# Altium project MSXIV_SolarSense.PrjPcb (part 1 of 3)
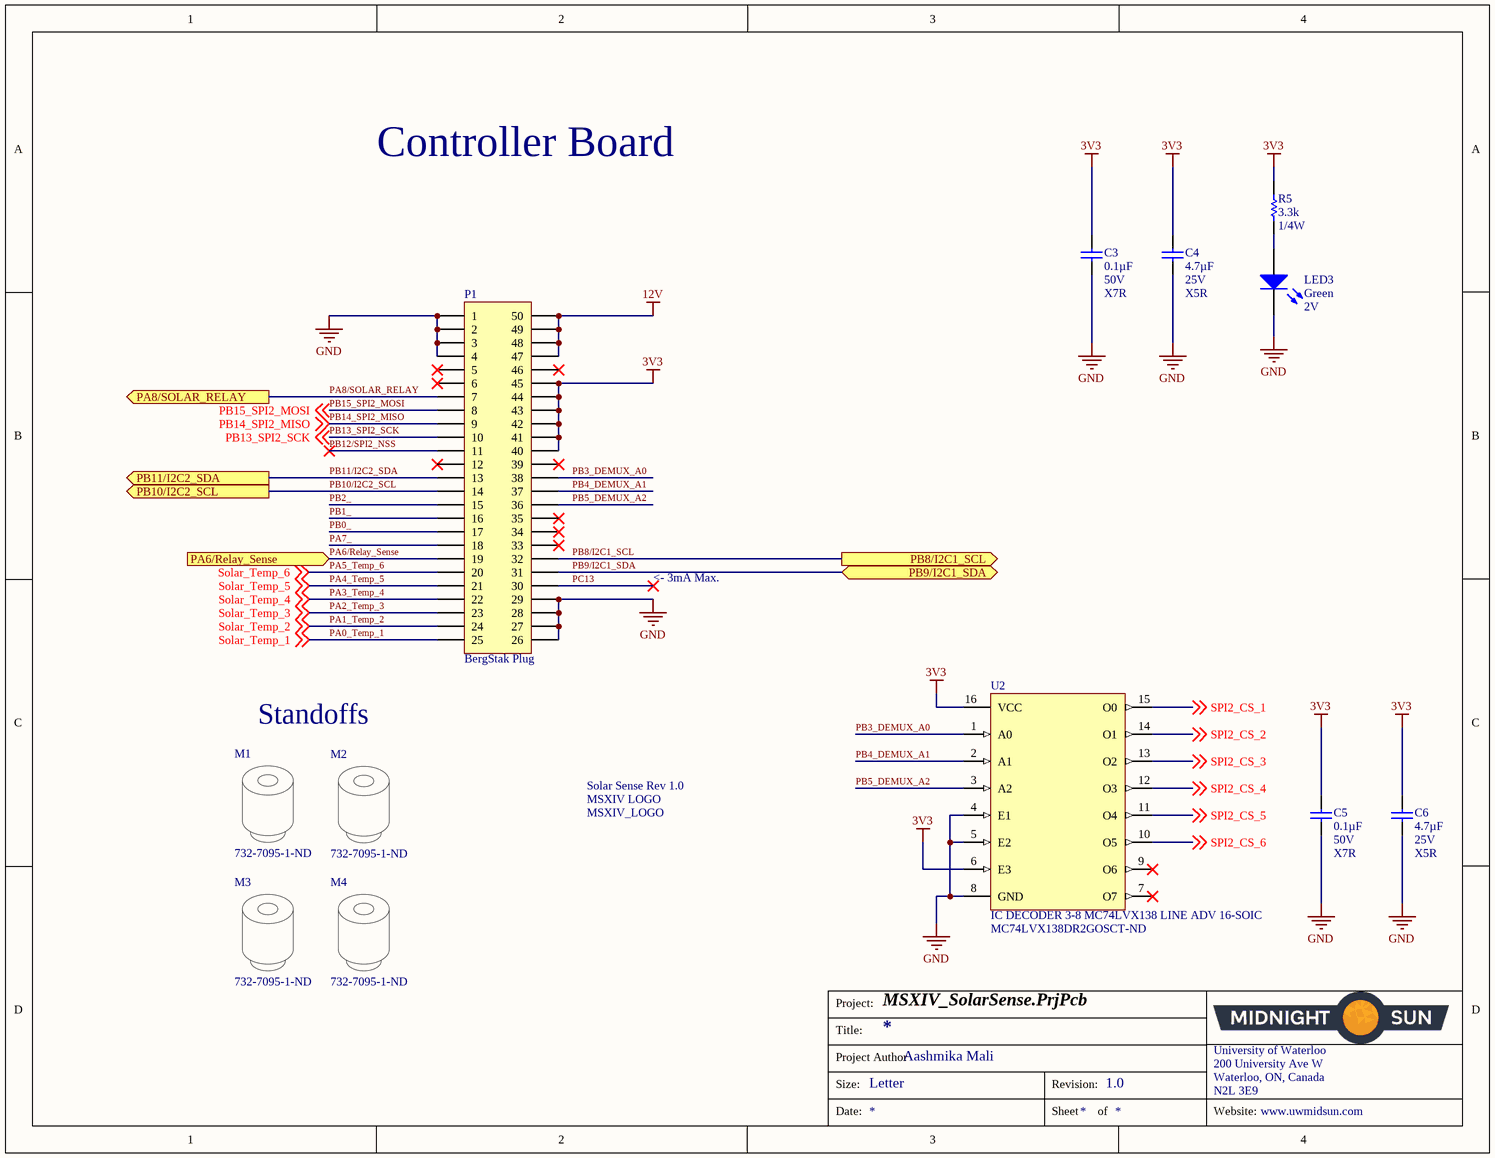
[diagram p0: Controller_Board_Interface.SchDoc]
ProjectAuthor: Aashmika Mali; ProjectRevision: 1.0
8 sheets, 208 parts. Net scope: flat (ports and power ports of the same name join across sheets).
Board file: SolarSense.PcbDoc
Sheets:
  Controller_Board_Interface.SchDoc
  Voltage_Sense.SchDoc
  ADCs.SchDoc
  SPI_Interface.SchDoc
  Current_and_Relay_Sense.SchDoc
  TemperatureSense.SchDoc
  I2C_Interface.SchDoc
  V_Sns_I2C_Isolators.SchDoc

## Sheet Controller_Board_Interface.SchDoc
size Letter; Organization: Midnight Sun Solar Rayce Car Team; Address1: University of Waterloo; Address2: 200 University Ave W; Address3: Waterloo, ON, Canada; Address4: N2L 3E9; Website: www.uwmidsun.com

### Parts
C3  Capacitance: 0.1µF  Voltage: 50V  Temperature Coefficient: X7R  [CAP, 0603]  (hidden comment: CAP CER 0.1UF 50V 10% X7R 0603)
C4  Capacitance: 4.7µF  Voltage: 25V  Temperature Coefficient: X5R  [CAP, 0603]  (hidden comment: CAP CER 4.7UF 25V 10% X5R 0603)
C5  Capacitance: 0.1µF  Voltage: 50V  Temperature Coefficient: X7R  [CAP, 0603]  (hidden comment: CAP CER 0.1UF 50V 10% X7R 0603)
C6  Capacitance: 4.7µF  Voltage: 25V  Temperature Coefficient: X5R  [CAP, 0603]  (hidden comment: CAP CER 4.7UF 25V 10% X5R 0603)
LED3  Color: Green  Voltage - Forward (Vf) (Typ): 2V  [LED_0603]  (hidden comment: LED GREEN CLEAR 2V 0603)
M1  Supplier Part Number 1: 732-7095-1-ND  [M2.5 Standoff]  (hidden comment: STANDOFF RND M2.5X0.45 STEEL 5MM)
M2  Supplier Part Number 1: 732-7095-1-ND  [M2.5 Standoff]  (hidden comment: STANDOFF RND M2.5X0.45 STEEL 5MM)
M3  Supplier Part Number 1: 732-7095-1-ND  [M2.5 Standoff]  (hidden comment: STANDOFF RND M2.5X0.45 STEEL 5MM)
M4  Supplier Part Number 1: 732-7095-1-ND  [M2.5 Standoff]  (hidden comment: STANDOFF RND M2.5X0.45 STEEL 5MM)
P1  Series: BergStak Plug  [CONN, Bergstak 50 Pos Plug]  (hidden comment: CONN 50POS Bergstak Plug 0.02")
R5  Resistance: 3.3k  Power: 1/4W  [RES, 0603]  (hidden comment: RES 3.3K OHM 1% 1/4W 0603)
Solar_Sense_Rev_1.0  MSXIV_LOGO  [MSXIV LOGO]
U2  IC DECODER 3-8 MC74LVX138 LINE ADV 16-SOIC  Supplier Part Number 1: MC74LVX138DR2GOSCT-ND  [SOIC-16 CASE 751B-05 ISSUE K MC74LVX138]

### Ports
PA6/Relay_Sense (in), PA8/SOLAR_RELAY (out), PB8/I2C1_SCL (out), PB9/I2C1_SDA (bidir), PB10/I2C2_SCL (out), PB11/I2C2_SDA (out)

### Nets
3V3: C3.1 C4.1 C5.1 C6.1 P1.40 P1.41 P1.42 P1.43 P1.44 P1.45 R5.1 U2.6(E3) U2.16(VCC)
12V: P1.47 P1.48 P1.49 P1.50
GND: C3.2 C4.2 C5.2 C6.2 LED3.2(K) P1.1 P1.2 P1.3 P1.4 P1.26 P1.27 P1.28 P1.29 U2.4(E1) U2.5(E2) U2.8(GND)
PA0_Temp_1: P1.25 ; off-sheet Solar_Temp_1  [also labelled Solar_Temp_1]
PA1_Temp_2: P1.24 ; off-sheet Solar_Temp_2  [also labelled Solar_Temp_2]
PA2_Temp_3: P1.23 ; off-sheet Solar_Temp_3  [also labelled Solar_Temp_3]
PA3_Temp_4: P1.22 ; off-sheet Solar_Temp_4  [also labelled Solar_Temp_4]
PA4_Temp_5: P1.21 ; off-sheet Solar_Temp_5  [also labelled Solar_Temp_5]
PA5_Temp_6: P1.20 ; off-sheet Solar_Temp_6  [also labelled Solar_Temp_6]
PA6/Relay_Sense: P1.19 ; port PA6/Relay_Sense
PA7_: P1.18
PA8/SOLAR_RELAY: P1.7 ; port PA8/SOLAR_RELAY
PB0_: P1.17
PB1_: P1.16
PB2_: P1.15
PB3_DEMUX_A0: P1.38 U2.1(A0)
PB4_DEMUX_A1: P1.37 U2.2(A1)
PB5_DEMUX_A2: P1.36 U2.3(A2)
PB8/I2C1_SCL: P1.32 ; port PB8/I2C1_SCL
PB9/I2C1_SDA: P1.31 ; port PB9/I2C1_SDA
PB10/I2C2_SCL: P1.14 ; port PB10/I2C2_SCL
PB11/I2C2_SDA: P1.13 ; port PB11/I2C2_SDA
PB12/SPI2_NSS: P1.11
PB13_SPI2_SCK: P1.10 ; off-sheet PB13_SPI2_SCK
PB14_SPI2_MISO: P1.9 ; off-sheet PB14_SPI2_MISO
PB15_SPI2_MOSI: P1.8 ; off-sheet PB15_SPI2_MOSI
PC13: P1.30
SPI2_CS_1: U2.15(O0) ; off-sheet SPI2_CS_1
SPI2_CS_2: U2.14(O1) ; off-sheet SPI2_CS_2
SPI2_CS_3: U2.13(O2) ; off-sheet SPI2_CS_3
SPI2_CS_4: U2.12(O3) ; off-sheet SPI2_CS_4
SPI2_CS_5: U2.11(O4) ; off-sheet SPI2_CS_5
SPI2_CS_6: U2.10(O5) ; off-sheet SPI2_CS_6
NetLED3_1: LED3.1(A) R5.2

Not connected (* = marked no-connect by the designer): P1 5* 6* 12* 33* 34* 35* 39* 46*; U2 7(O7)* 9(O6)*

### Notes on the sheet
- Controller Board
- <- 3mA Max.
- Standoffs
- Project:
- Title:
- Size:
- Project Author
- Letter
- Revision:
- University of Waterloo
- 200 University Ave W
- Waterloo, ON, Canada
- N2L 3E9
- Date:
- Sheet
- of
- Website:
- (in symbol MSXIV_LOGO) MSXIV LOGO

### Library data of the parts
C3 C5 = CAP CER 0.1UF 50V 10% X7R 0603: 0.10µF ±10% 50V Ceramic Capacitor X7R 0603 (1608 Metric); Manufacturer 1: AVX Corporation; Manufacturer Part Number 1: 06035C104KAT2A; Supplier 1: Digi-Key; Supplier Part Number 1: 478-5052-1-ND; Packaging: Cut Tape (CT); Part Status: Active; Operating Temperature: -55°C ~ 125°C; Ratings: -; Mounting Type: Surface Mount, MLCC; Package / Case: 0603 (1608 Metric); Size / Dimension: 0.063" L x 0.032" W (1.60mm x 0.81mm); Height - Seated (Max): -; Thickness (Max): 0.035" (0.90mm); Lead Spacing: -; Lead Style: -; ComponentLink1URL: http://datasheets.avx.com/X7RDielectric.pdf; ComponentLink1Description: http://datasheets.avx.com/X7RDielectric.pdf; Tolerance: ±10%
C4 C6 = CAP CER 4.7UF 25V 10% X5R 0603: 4.7µF ±10% 25V Ceramic Capacitor X5R 0603 (1608 Metric); Manufacturer 1: Murata Electronics North America; Manufacturer Part Number 1: GRM188R61E475KE11D; Supplier 1: Digi-Key; Supplier Part Number 1: 490-7203-1-ND; Packaging: Cut Tape (CT); Part Status: Active; Operating Temperature: -55°C ~ 85°C; Ratings: -; Mounting Type: Surface Mount, MLCC; Package / Case: 0603 (1608 Metric); Size / Dimension: 0.063" L x 0.031" W (1.60mm x 0.80mm); Height - Seated (Max): -; Thickness (Max): 0.031" (0.80mm); Lead Spacing: -; Lead Style: -; ComponentLink1URL: http://www.murata.com/~/media/webrenewal/support/library/catalog/products/capacitor/mlcc/c02e.ashx; ComponentLink1Description: http://www.murata.com/~/media/webrenewal/support/library/catalog/products/capacitor/mlcc/c02e.ashx; Tolerance: ±10%
LED3 = LED GREEN CLEAR 2V 0603: Green 572nm LED Indication - Discrete 2V 0603 (1608 Metric); Manufacturer: Wurth Electronics Inc.; Manufacturer Part Number: 150060VS75000; Lens Color: Colorless; Millicandela Rating: 40mcd; Lens Style/Size: Rectangle with Flat Top, 1.10mm x 0.70mm; Current - Test: 20mA; Viewing Angle: 140°; Wavelength - Dominant: 570nm; Supplier 1: Digi-Key; RoHS: RoHS Compliant; Category: Optoelectronics; Stock 1: 9408; Pricing 1: 1=0.21, 100=0.1617, 500=0.13964 (CAD); Packaging: Cut Tape (CT); Part Status: Active; Lens Transparency: Clear; Mounting Type: Surface Mount; Wavelength - Peak: 572nm; Features: -; Package / Case: 0603 (1608 Metric); Supplier Device Package: 0603; Size / Dimension: 1.60mm L x 0.80mm W; Height (Max): 0.80mm; ComponentLink1URL: http://katalog.we-online.de/led/datasheet/150060VS75000.pdf; ComponentLink1Description: http://katalog.we-online.de/led/datasheet/150060VS75000.pdf; Supplier Part Number 1: 732-4980-1-ND
M1-M4 = STANDOFF RND M2.5X0.45 STEEL 5MM: Manufacturer: Wurth Electronics; Manufacturer Part Number: 9774050151R; Plating: Tin; Threaded/Unthreaded: Threaded; Outside Diameter: 0.201inch; Supplier 1: Digi-Key; RoHS: Yes; Stock 1: 24846; Pricing 1: 1 = 1.09000, 10 = 1.03000, 50 = 0.91800, 100 = 0.84000 (USD); Material: Steel; Length: 0.252inch; REACH SVHC: Unknown
P1 = CONN 50POS Bergstak Plug 0.02": 50 Position Connector Plug, Outer Shroud Contacts Surface Mount Gold; Manufacturer 1: Amphenol FCI; Manufacturer Part Number 1: 10132797-055100LF; Number of Positions: 50; Mated Stacking Heights: 5mm; Pitch: 0.020" (0.50mm); Supplier 1: Digi-Key; Supplier Part Number 1: 609-5226-1-ND; Packaging: Cut Tape (CT); Part Status: Active; Connector Type: Plug, Outer Shroud Contacts; Number of Rows: 2; Mounting Type: Surface Mount; Contact Finish: Gold; Contact Finish Thickness: 1µin (0.025µm); Height Above Board: 0.169" (4.30mm); ComponentLink1URL: http://portal.fciconnect.com/Comergent//fci/drawing/10132797.pdf; ComponentLink1Description: http://portal.fciconnect.com/Comergent//fci/drawing/10132797.pdf
R5 = RES 3.3K OHM 1% 1/4W 0603: 3.3k Ohm ±1% 0.25W, 1/4W Chip Resistor 0603 (1608 Metric) Automotive AEC-Q200, Pulse Withstanding Thick Film; Manufacturer 1: Panasonic Electronic Components; Manufacturer Part Number 1: ERJ-PA3F3301V; Temperature Coefficient: ±100ppm/°C; Supplier 1: Digi-Key; Supplier Part Number 1: P3.3KBYCT-ND; Packaging: Cut Tape (CT); Part Status: Active; Composition: Thick Film; Operating Temperature: -55°C ~ 155°C; Package / Case: 0603 (1608 Metric); Supplier Device Package: 0603; Size / Dimension: 0.063" L x 0.031" W (1.60mm x 0.80mm); Height - Seated (Max): 0.022" (0.55mm); Failure Rate: -; ComponentLink1URL: https://industrial.panasonic.com/cdbs/www-data/pdf/RDO0000/AOA0000C291.pdf; ComponentLink1Description: https://industrial.panasonic.com/cdbs/www-data/pdf/RDO0000/AOA0000C291.pdf; Tolerance: ±1%
U2 = IC DECODER 3-8 MC74LVX138 LINE ADV 16-SOIC: Decoder/Demultiplexer 1 x 3:8 16-SOIC; Manufacturer: ON Semiconductor; Manufacturer Part Number: MC74LVX138DR2G; Number of Inputs: 3; Number of Outputs: 8; Propagation Delay: 23ns; Max Supply Voltage: 3.6V; Min Supply Voltage: 2V; Logic Function: Demultiplexer,Decoder; Number of Elements: 1; High Level Output Current: 4mA; Polarity: Inverting; Quiescent Current: 4uA; Supply Type: Single; Supplier 1: Digi-Key; RoHS: Yes; Category: Decoders, Multiplexers; Stock 1: 2170; Pricing 1: 1=0.45000, 10=0.36100, 100=0.24590, 500=0.18442, 1000=0.13831 (USD); Mount: Surface Mount; Case/Package: SOIC; Number of Pins: 16; Min Operating Temperature: -40°C; Max Operating Temperature: 85°C; Packaging: Tape and Reel; Package Quantity: 2500; Low Level Output Current: 4mA; Number of Input Lines: 3; Number of Output Lines: 8; Turn-On Delay Time: 23ns; Independent Circuits: 1; Length: 10mm; Height: 1.5mm; Width: 4mm; Lead Free: Lead Free; Halogen Free: Halogen Free; ComponentLink1URL: https://datasheet.ciiva.com/6615/mc74lvx138-d-6615404.pdf?src-supplier=Digi-Key; ComponentLink1Description: https://datasheet.ciiva.com/6615/mc74lvx138-d-6615404.pdf?src-supplier=Digi-Key; ComponentLink2URL: https://datasheet.ciiva.com/16386/mc74lvx138-d-16386958.pdf?src-supplier=Future+Electronics; ComponentLink2Description: https://datasheet.ciiva.com/16386/mc74lvx138-d-16386958.pdf?src-supplier=Future+Electronics; ComponentLink3URL: https://datasheet.ciiva.com/6615/mc74lvx138-d-6615402.pdf?src-supplier=Digi-Key; ComponentLink3Description: https://datasheet.ciiva.com/6615/mc74lvx138-d-6615402.pdf?src-supplier=Digi-Key; ComponentLink4URL: https://datasheet.ciiva.com/6615/mc74lvx138-d-6615405.pdf?src-supplier=Digi-Key; ComponentLink4Description: https://datasheet.ciiva.com/6615/mc74lvx138-d-6615405.pdf?src-supplier=Digi-Key

## Sheet Voltage_Sense.SchDoc: Solar Sense Slave
size Tabloid; SheetNumber: 3; SheetTotal: 4; Website: www.uwmidsun.com
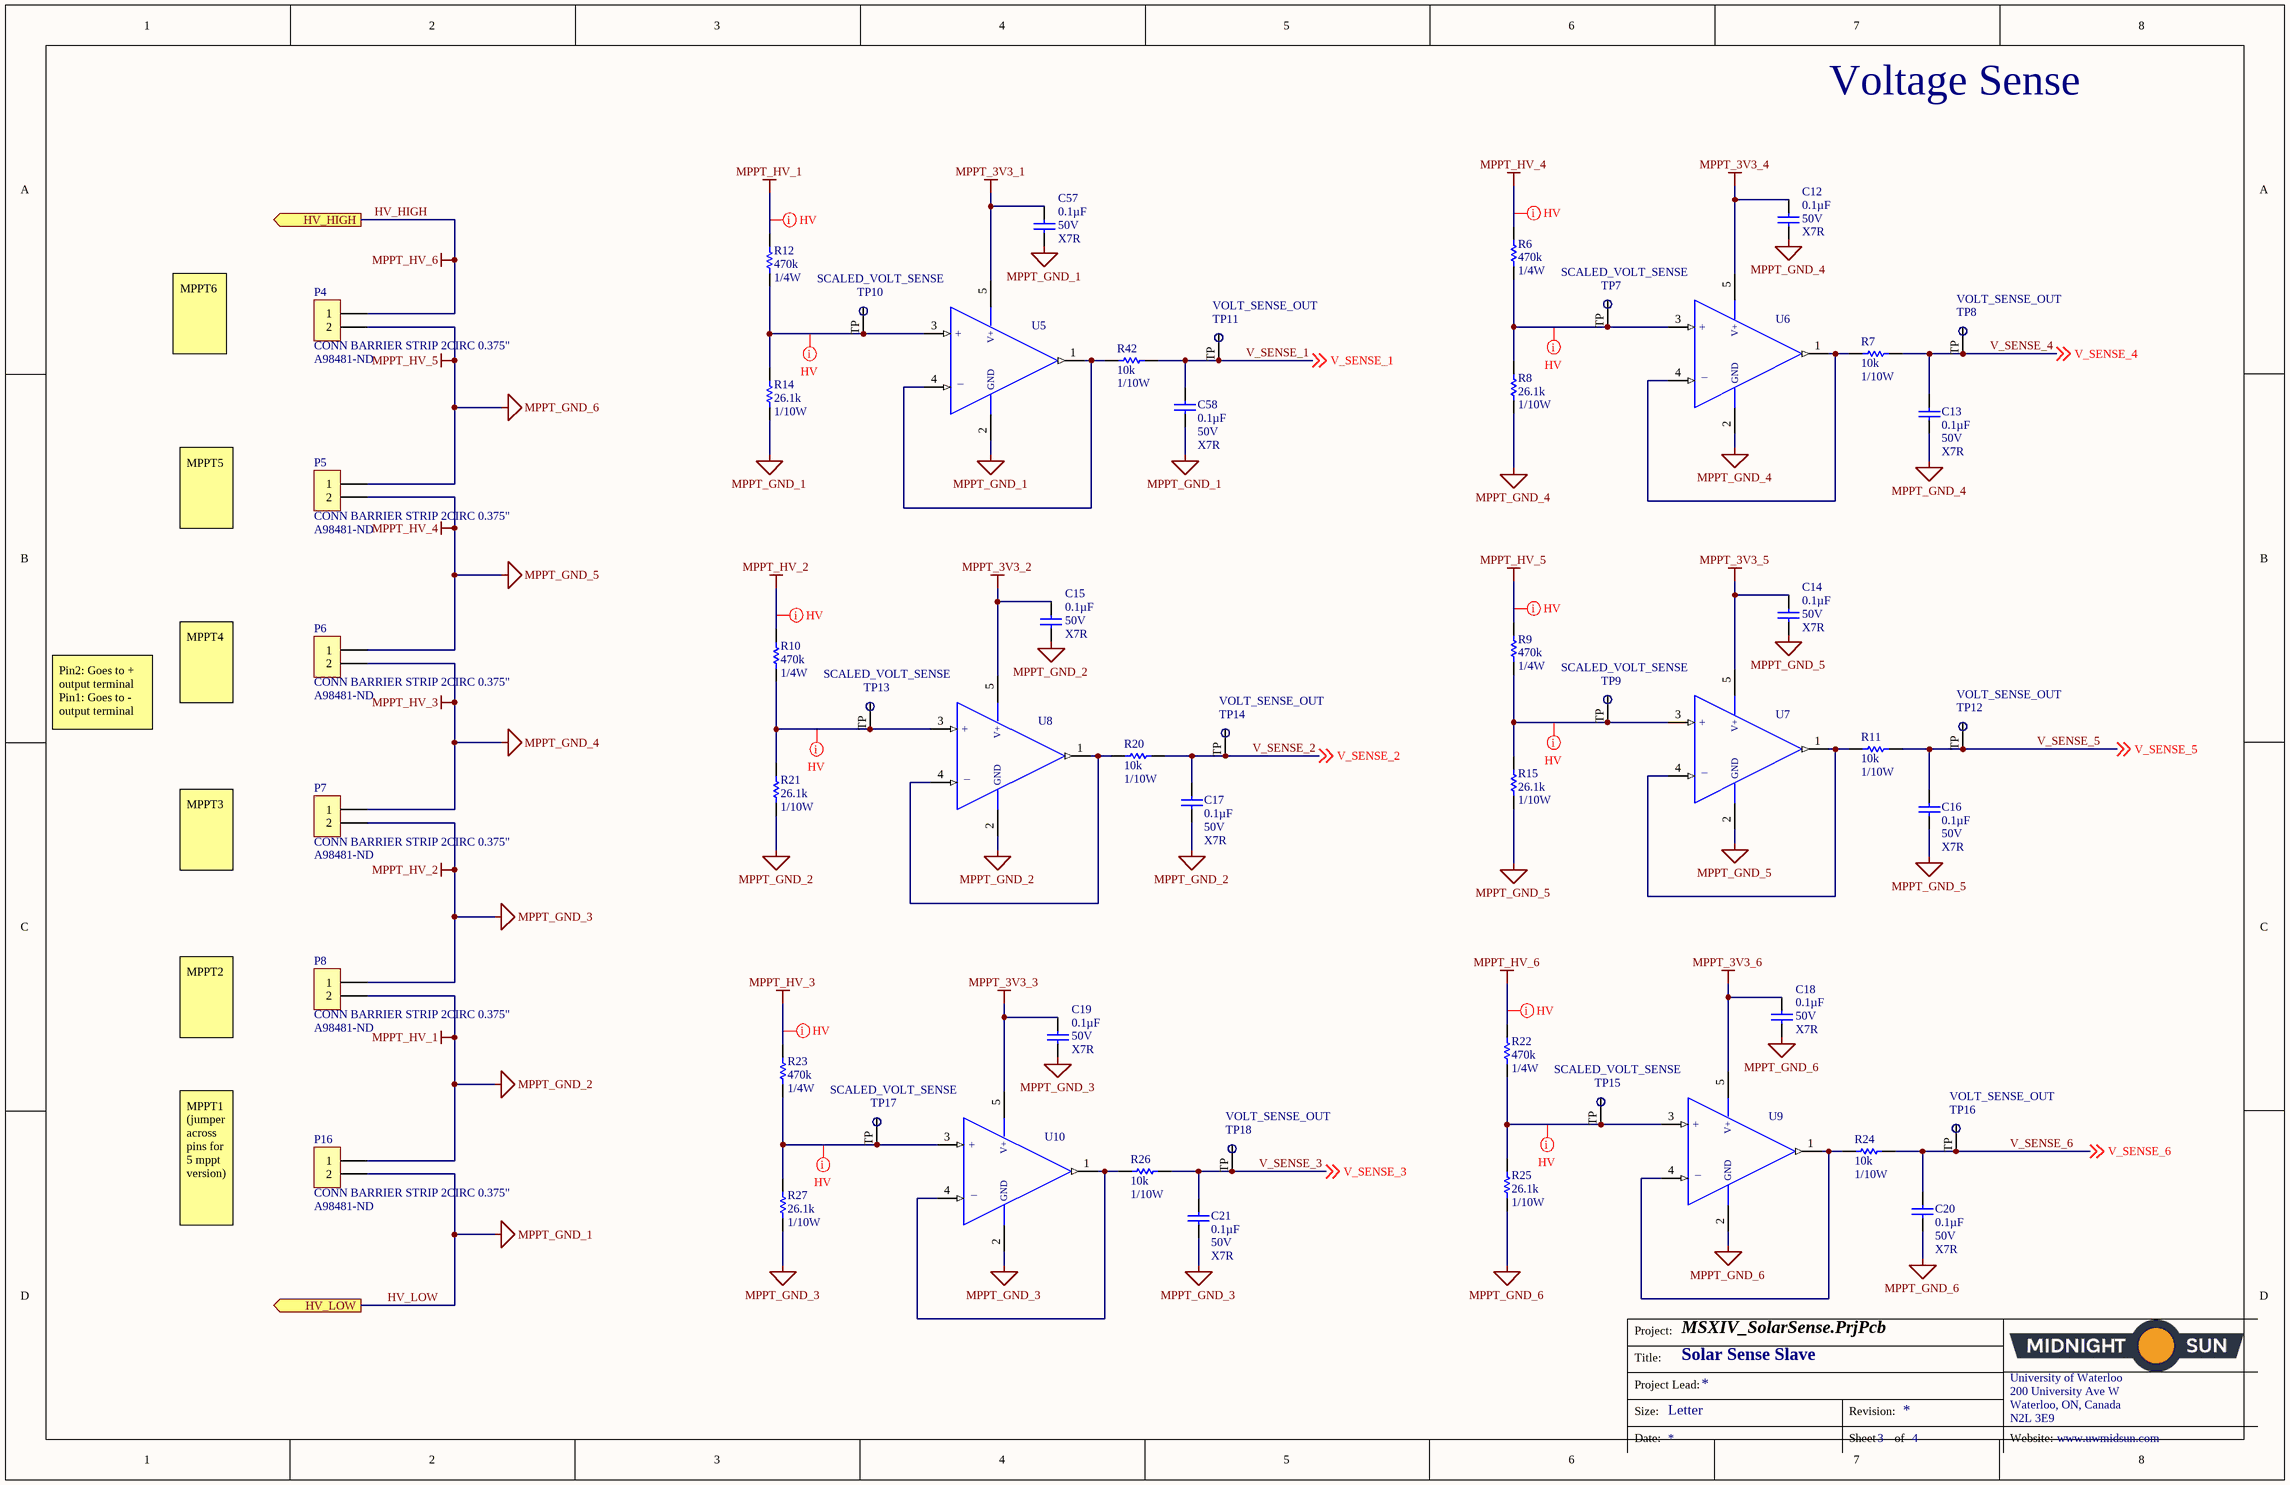
[diagram p1: Voltage_Sense.SchDoc]

### Parts
C12  Capacitance: 0.1µF  Voltage: 50V  Temperature Coefficient: X7R  [CAP, 0603]  (hidden comment: CAP CER 0.1UF 50V 10% X7R 0603)
C13  Capacitance: 0.1µF  Voltage: 50V  Temperature Coefficient: X7R  [CAP, 0603]  (hidden comment: CAP CER 0.1UF 50V 10% X7R 0603)
C14  Capacitance: 0.1µF  Voltage: 50V  Temperature Coefficient: X7R  [CAP, 0603]  (hidden comment: CAP CER 0.1UF 50V 10% X7R 0603)
C15  Capacitance: 0.1µF  Voltage: 50V  Temperature Coefficient: X7R  [CAP, 0603]  (hidden comment: CAP CER 0.1UF 50V 10% X7R 0603)
C16  Capacitance: 0.1µF  Voltage: 50V  Temperature Coefficient: X7R  [CAP, 0603]  (hidden comment: CAP CER 0.1UF 50V 10% X7R 0603)
C17  Capacitance: 0.1µF  Voltage: 50V  Temperature Coefficient: X7R  [CAP, 0603]  (hidden comment: CAP CER 0.1UF 50V 10% X7R 0603)
C18  Capacitance: 0.1µF  Voltage: 50V  Temperature Coefficient: X7R  [CAP, 0603]  (hidden comment: CAP CER 0.1UF 50V 10% X7R 0603)
C19  Capacitance: 0.1µF  Voltage: 50V  Temperature Coefficient: X7R  [CAP, 0603]  (hidden comment: CAP CER 0.1UF 50V 10% X7R 0603)
C20  Capacitance: 0.1µF  Voltage: 50V  Temperature Coefficient: X7R  [CAP, 0603]  (hidden comment: CAP CER 0.1UF 50V 10% X7R 0603)
C21  Capacitance: 0.1µF  Voltage: 50V  Temperature Coefficient: X7R  [CAP, 0603]  (hidden comment: CAP CER 0.1UF 50V 10% X7R 0603)
C57  Capacitance: 0.1µF  Voltage: 50V  Temperature Coefficient: X7R  [CAP, 0603]  (hidden comment: CAP CER 0.1UF 50V 10% X7R 0603)
C58  Capacitance: 0.1µF  Voltage: 50V  Temperature Coefficient: X7R  [CAP, 0603]  (hidden comment: CAP CER 0.1UF 50V 10% X7R 0603)
P4  CONN BARRIER STRIP 2CIRC 0.375"  Supplier Part Number 1: A98481-ND  [TE_3-1437652-9]
P5  CONN BARRIER STRIP 2CIRC 0.375"  Supplier Part Number 1: A98481-ND  [TE_3-1437652-9]
P6  CONN BARRIER STRIP 2CIRC 0.375"  Supplier Part Number 1: A98481-ND  [TE_3-1437652-9]
P7  CONN BARRIER STRIP 2CIRC 0.375"  Supplier Part Number 1: A98481-ND  [TE_3-1437652-9]
P8  CONN BARRIER STRIP 2CIRC 0.375"  Supplier Part Number 1: A98481-ND  [TE_3-1437652-9]
P16  CONN BARRIER STRIP 2CIRC 0.375"  Supplier Part Number 1: A98481-ND  [TE_3-1437652-9]
R6  Resistance: 470k  Power: 1/4W  [RES, 0603]  (hidden comment: RES 470K OHM 1% 1/4W 0603)
R7  Resistance: 10k  Power: 1/10W  [RES, 0603]  (hidden comment: RES 10K OHM 1% 1/10W 0603)
R8  Resistance: 26.1k  Power: 1/10W  [RES, 0603]  (hidden comment: RES 26.1K OHM 1% 1/10W 0603)
R9  Resistance: 470k  Power: 1/4W  [RES, 0603]  (hidden comment: RES 470K OHM 1% 1/4W 0603)
R10  Resistance: 470k  Power: 1/4W  [RES, 0603]  (hidden comment: RES 470K OHM 1% 1/4W 0603)
R11  Resistance: 10k  Power: 1/10W  [RES, 0603]  (hidden comment: RES 10K OHM 1% 1/10W 0603)
R12  Resistance: 470k  Power: 1/4W  [RES, 0603]  (hidden comment: RES 470K OHM 1% 1/4W 0603)
R14  Resistance: 26.1k  Power: 1/10W  [RES, 0603]  (hidden comment: RES 26.1K OHM 1% 1/10W 0603)
R15  Resistance: 26.1k  Power: 1/10W  [RES, 0603]  (hidden comment: RES 26.1K OHM 1% 1/10W 0603)
R20  Resistance: 10k  Power: 1/10W  [RES, 0603]  (hidden comment: RES 10K OHM 1% 1/10W 0603)
R21  Resistance: 26.1k  Power: 1/10W  [RES, 0603]  (hidden comment: RES 26.1K OHM 1% 1/10W 0603)
R22  Resistance: 470k  Power: 1/4W  [RES, 0603]  (hidden comment: RES 470K OHM 1% 1/4W 0603)
R23  Resistance: 470k  Power: 1/4W  [RES, 0603]  (hidden comment: RES 470K OHM 1% 1/4W 0603)
R24  Resistance: 10k  Power: 1/10W  [RES, 0603]  (hidden comment: RES 10K OHM 1% 1/10W 0603)
R25  Resistance: 26.1k  Power: 1/10W  [RES, 0603]  (hidden comment: RES 26.1K OHM 1% 1/10W 0603)
R26  Resistance: 10k  Power: 1/10W  [RES, 0603]  (hidden comment: RES 10K OHM 1% 1/10W 0603)
R27  Resistance: 26.1k  Power: 1/10W  [RES, 0603]  (hidden comment: RES 26.1K OHM 1% 1/10W 0603)
R42  Resistance: 10k  Power: 1/10W  [RES, 0603]  (hidden comment: RES 10K OHM 1% 1/10W 0603)
TP7  SCALED_VOLT_SENSE  [Test Point]  (no BOM)
TP8  VOLT_SENSE_OUT  [Test Point]
TP9  SCALED_VOLT_SENSE  [Test Point]  (no BOM)
TP10  SCALED_VOLT_SENSE  [Test Point]  (no BOM)
TP11  VOLT_SENSE_OUT  [Test Point]
TP12  VOLT_SENSE_OUT  [Test Point]
TP13  SCALED_VOLT_SENSE  [Test Point]  (no BOM)
TP14  VOLT_SENSE_OUT  [Test Point]
TP15  SCALED_VOLT_SENSE  [Test Point]  (no BOM)
TP16  VOLT_SENSE_OUT  [Test Point]
TP17  SCALED_VOLT_SENSE  [Test Point]  (no BOM)
TP18  VOLT_SENSE_OUT  [Test Point]
U5  IC OP AMP GEN PURPOSE RR 10MHZ SOT-23-5  [IC OP AMP GP RR 10MHZ SOT-23-5]  (value not drawn)
U6  IC OP AMP GEN PURPOSE RR 10MHZ SOT-23-5  [IC OP AMP GP RR 10MHZ SOT-23-5]  (value not drawn)
U7  IC OP AMP GEN PURPOSE RR 10MHZ SOT-23-5  [IC OP AMP GP RR 10MHZ SOT-23-5]  (value not drawn)
U8  IC OP AMP GEN PURPOSE RR 10MHZ SOT-23-5  [IC OP AMP GP RR 10MHZ SOT-23-5]  (value not drawn)
U9  IC OP AMP GEN PURPOSE RR 10MHZ SOT-23-5  [IC OP AMP GP RR 10MHZ SOT-23-5]  (value not drawn)
U10  IC OP AMP GEN PURPOSE RR 10MHZ SOT-23-5  [IC OP AMP GP RR 10MHZ SOT-23-5]  (value not drawn)

### Ports
HV_HIGH (out), HV_LOW (out)

### Nets
HV_HIGH: P4.1 R22.1 ; port HV_HIGH  [also labelled MPPT_HV_6]
HV_LOW: C57.2 C58.2 P16.2 R14.2 U5.2(VSS) ; port HV_LOW  [also labelled MPPT_GND_1]  [project net HV_HIGH_NEG_BAT_TERM]
MPPT_3V3_1: C57.1 U5.5(VDD)
MPPT_3V3_2: C15.1 U8.5(VDD)
MPPT_3V3_3: C19.1 U10.5(VDD)
MPPT_3V3_4: C12.1 U6.5(VDD)
MPPT_3V3_5: C14.1 U7.5(VDD)
MPPT_3V3_6: C18.1 U9.5(VDD)
MPPT_GND_2: C15.2 C17.2 P8.2 P16.1 R12.1 R21.2 U8.2(VSS)  [also labelled MPPT_HV_1]
MPPT_GND_3: C19.2 C21.2 P7.2 P8.1 R10.1 R27.2 U10.2(VSS)  [also labelled MPPT_HV_2]
MPPT_GND_4: C12.2 C13.2 P6.2 P7.1 R8.2 R23.1 U6.2(VSS)  [also labelled MPPT_HV_3]
MPPT_GND_5: C14.2 C16.2 P5.2 P6.1 R6.1 R15.2 U7.2(VSS)  [also labelled MPPT_HV_4]
MPPT_GND_6: C18.2 C20.2 P4.2 P5.1 R9.1 R25.2 U9.2(VSS)  [also labelled MPPT_HV_5]
V_SENSE_1: C58.1 R42.2 TP11.TP ; off-sheet V_SENSE_1
V_SENSE_2: C17.1 R20.2 TP14.TP ; off-sheet V_SENSE_2
V_SENSE_3: C21.1 R26.2 TP18.TP ; off-sheet V_SENSE_3
V_SENSE_4: C13.1 R7.2 TP8.TP ; off-sheet V_SENSE_4
V_SENSE_5: C16.1 R11.2 TP12.TP ; off-sheet V_SENSE_5
V_SENSE_6: C20.1 R24.2 TP16.TP ; off-sheet V_SENSE_6
NetR6_2: R6.2 R8.1 TP7.TP U6.3(+IN)
NetR7_1: R7.1 U6.1(OUTPUT) U6.4(-IN)
NetR9_2: R9.2 R15.1 TP9.TP U7.3(+IN)
NetR10_2: R10.2 R21.1 TP13.TP U8.3(+IN)
NetR11_1: R11.1 U7.1(OUTPUT) U7.4(-IN)
NetR12_2: R12.2 R14.1 TP10.TP U5.3(+IN)
NetR20_1: R20.1 U8.1(OUTPUT) U8.4(-IN)
NetR22_2: R22.2 R25.1 TP15.TP U9.3(+IN)
NetR23_2: R23.2 R27.1 TP17.TP U10.3(+IN)
NetR24_1: R24.1 U9.1(OUTPUT) U9.4(-IN)
NetR26_1: R26.1 U10.1(OUTPUT) U10.4(-IN)
NetR42_1: R42.1 U5.1(OUTPUT) U5.4(-IN)

### Layout directives
net class HV: HV_HIGH, MPPT_GND_2, MPPT_GND_3, MPPT_GND_4, MPPT_GND_5, MPPT_GND_6, NetR6_2, NetR9_2, NetR10_2, NetR12_2, NetR22_2, NetR23_2

### Notes on the sheet
- Voltage Sense
- MPPT6
- MPPT5
- MPPT4
- Pin2: Goes to + output terminal
  Pin1: Goes to - output terminal
- MPPT3
- MPPT2
- MPPT1 (jumper across pins for 5 mppt version)
- Project:
- Title:
- Size:
- Project Lead:
- Letter
- Revision:
- University of Waterloo
- 200 University Ave W
- Waterloo, ON, Canada
- N2L 3E9
- Date:
- Sheet
- of
- Website:
- (in symbol IC OP AMP GEN PURPOSE RR 10MHZ SOT-23-5) V+; +; GND; _

### Library data of the parts
C12-C21 C57 C58 = CAP CER 0.1UF 50V 10% X7R 0603: as C3 on sheet Controller_Board_Interface; Supplier 1: Digi-Key; Supplier Part Number 1: 478-5052-1-ND; Packaging: Cut Tape (CT); Part Status: Active; Operating Temperature: -55°C ~ 125°C; Ratings: -; Mounting Type: Surface Mount, MLCC; Package / Case: 0603 (1608 Metric); Size / Dimension: 0.063" L x 0.032" W (1.60mm x 0.81mm); Height - Seated (Max): -; Thickness (Max): 0.035" (0.90mm); Lead Spacing: -; Lead Style: -; ComponentLink1URL: http://datasheets.avx.com/X7RDielectric.pdf; ComponentLink1Description: http://datasheets.avx.com/X7RDielectric.pdf; Tolerance: ±10%
P4-P8 P16 = CONN BARRIER STRIP 2CIRC 0.375": Barrier Terminal Blocks 2P TRI-BARRIER .375; Manufacturer: TE Connectivity; Manufacturer Part Number: 6PCV-02-006; Current Rating: 5A; Voltage Rating: 300V; Number of Contacts: 2; Max Current Rating: 25A; Mounting Ears: No (Without); Number of Levels: 1; Wire Gauge (Max): 12AWG; Wire Gauge (Min): 22AWG; Pitch: 9.53mm; Supplier 1: Digi-Key; RoHS: Yes; Category: Terminal Blocks; Stock 1: 8088; Pricing 1: 1=1.63000, 10=1.14400, 25=1.06680, 50=0.96820, 100=0.96400, 250=0.81404, 500=0.77122, 1000=0.68552, 5000=0.55699 (USD); Mount: Through Hole; Color: Black; Terminal Material: Copper Alloy; Contact Plating: Tin; Contact Material: Copper Alloy; Housing Color: Black; Housing Material: Thermoplastic; Package Quantity: 270; Number of Rows: 1; Packaging: Bulk; Termination: Solder; Number of Circuits: 2; Orientation: Straight; Number of Positions: 2; Mounting Insert: No (Without); Voltage: 300V; Length: 0.811inch; Height: 0.625inch; Wire/Cable Gauge: 22AWG; Width: 0.7inch; Flammability Rating: UL94 V-0; REACH SVHC: Unknown; ELV: Compliant; ComponentLink1URL: https://datasheet.ciiva.com/7978/1650932-7978603.pdf?src-supplier=Element14; ComponentLink1Description: https://datasheet.ciiva.com/7978/1650932-7978603.pdf?src-supplier=Element14
R6 R9 R10 R12 R22 R23 = RES 470K OHM 1% 1/4W 0603: RES SMD 470K OHM 1% 1/4W 0603; Manufacturer 1: Panasonic Electronic Components; Manufacturer Part Number 1: ERJ-PA3F4703V; Temperature Coefficient: ±100ppm/°C; Supplier 1: Digi-Key; Supplier Part Number 1: P470KBYCT-ND; Packaging: Cut Tape (CT); Part Status: Active; Composition: Thick Film; Operating Temperature: -55°C ~ 155°C; Package / Case: 0603 (1608 Metric); Supplier Device Package: 0603; Size / Dimension: 0.063" L x 0.031" W (1.60mm x 0.80mm); Height - Seated (Max): 0.022" (0.55mm); Failure Rate: -; ComponentLink1URL: https://industrial.panasonic.com/cdbs/www-data/pdf/RDO0000/AOA0000C291.pdf; ComponentLink1Description: https://industrial.panasonic.com/cdbs/www-data/pdf/RDO0000/AOA0000C291.pdf; Tolerance: ±1%
R7 R11 R20 R24 R26 R42 = RES 10K OHM 1% 1/10W 0603: RES SMD 10K OHM 1% 1/10W 0603; Manufacturer 1: Yageo; Manufacturer Part Number 1: RC0603FR-0710KL; Temperature Coefficient: ±100ppm/°C; Supplier 1: Digi-Key; Supplier Part Number 1: 311-10.0KHRCT-ND; Packaging: Cut Tape (CT); Part Status: Active; Composition: Thick Film; Operating Temperature: -55°C ~ 155°C; Package / Case: 0603 (1608 Metric); Supplier Device Package: 0603; Size / Dimension: 0.063" L x 0.031" W (1.60mm x 0.80mm); Height - Seated (Max): 0.022" (0.55mm); Failure Rate: -; ComponentLink1URL: http://www.yageo.com/documents/recent/PYu-RC_Group_51_RoHS_L_7.pdf; ComponentLink1Description: http://www.yageo.com/documents/recent/PYu-RC_Group_51_RoHS_L_7.pdf; Tolerance: ±1%
R8 R14 R15 R21 R25 R27 = RES 26.1K OHM 1% 1/10W 0603: RES SMD 26.1K OHM 1% 1/10W 0603; Manufacturer 1: Yageo; Manufacturer Part Number 1: RC0603FR-0726K1L; Temperature Coefficient: ±100ppm/°C; Supplier 1: Digi-Key; Supplier Part Number 1: 311-26.1KHRCT-ND; Packaging: Cut Tape (CT); Part Status: Active; Composition: Thick Film; Operating Temperature: -55°C ~ 155°C; Package / Case: 0603 (1608 Metric); Supplier Device Package: 0603; Size / Dimension: 0.063" L x 0.031" W (1.60mm x 0.80mm); Height - Seated (Max): 0.022" (0.55mm); Failure Rate: -; ComponentLink1URL: http://www.yageo.com/documents/recent/PYu-RC_Group_51_RoHS_L_7.pdf; ComponentLink1Description: http://www.yageo.com/documents/recent/PYu-RC_Group_51_RoHS_L_7.pdf; Tolerance: ±1%
TP7-TP18 = Test Point
U5-U10 = IC OP AMP GEN PURPOSE RR 10MHZ SOT-23-5: General Purpose Amplifier 1 Circuit Rail-to-Rail SOT-23-5; Manufacturer 1: Texas Instruments; Manufacturer Part Number 1: TLV316QDBVRQ1; Description 1: IC OP AMP GP RR 10MHZ 5-SOT-23; Number of Circuits: 1; Slew Rate: 6 V/µs; Current - Supply: 400µA; Current - Output / Channel: 50mA; Voltage - Supply, Single/Dual (±): 1.8 V ~ 5.5 V, ±0.9 V ~ 2.75 V; Supplier 1: Digi-Key; Supplier Part Number 1: 296-45323-1-ND; RoHS: RoHS Compliant; Category: Integrated Circuits (ICs); Stock 1: 1747; Pricing 1: 1=1.33, 10=1.185, 100=0.9234, 500=0.76276, 1000=0.60218 (CAD); Packaging: Cut Tape (CT); Part Status: Active; Amplifier Type: General Purpose; Output Type: Rail-to-Rail; -3db Bandwidth: -; Operating Temperature: -40°C ~ 125°C; Mounting Type: Surface Mount; Package / Case: SC-74A, SOT-753; Supplier Device Package: SOT-23-5; ComponentLink1URL: http://www.ti.com/lit/ds/symlink/tlv316-q1.pdf; ComponentLink1Description: http://www.ti.com/lit/ds/symlink/tlv316-q1.pdf

## Sheet ADCs.SchDoc
size B; Organization: Midnight Sun Solar Rayce Car Team; Address1: University of Waterloo; Address2: 200 University Ave W; Address3: Waterloo, ON, Canada; Address4: N2L 3E9; Website: www.uwmidsun.com
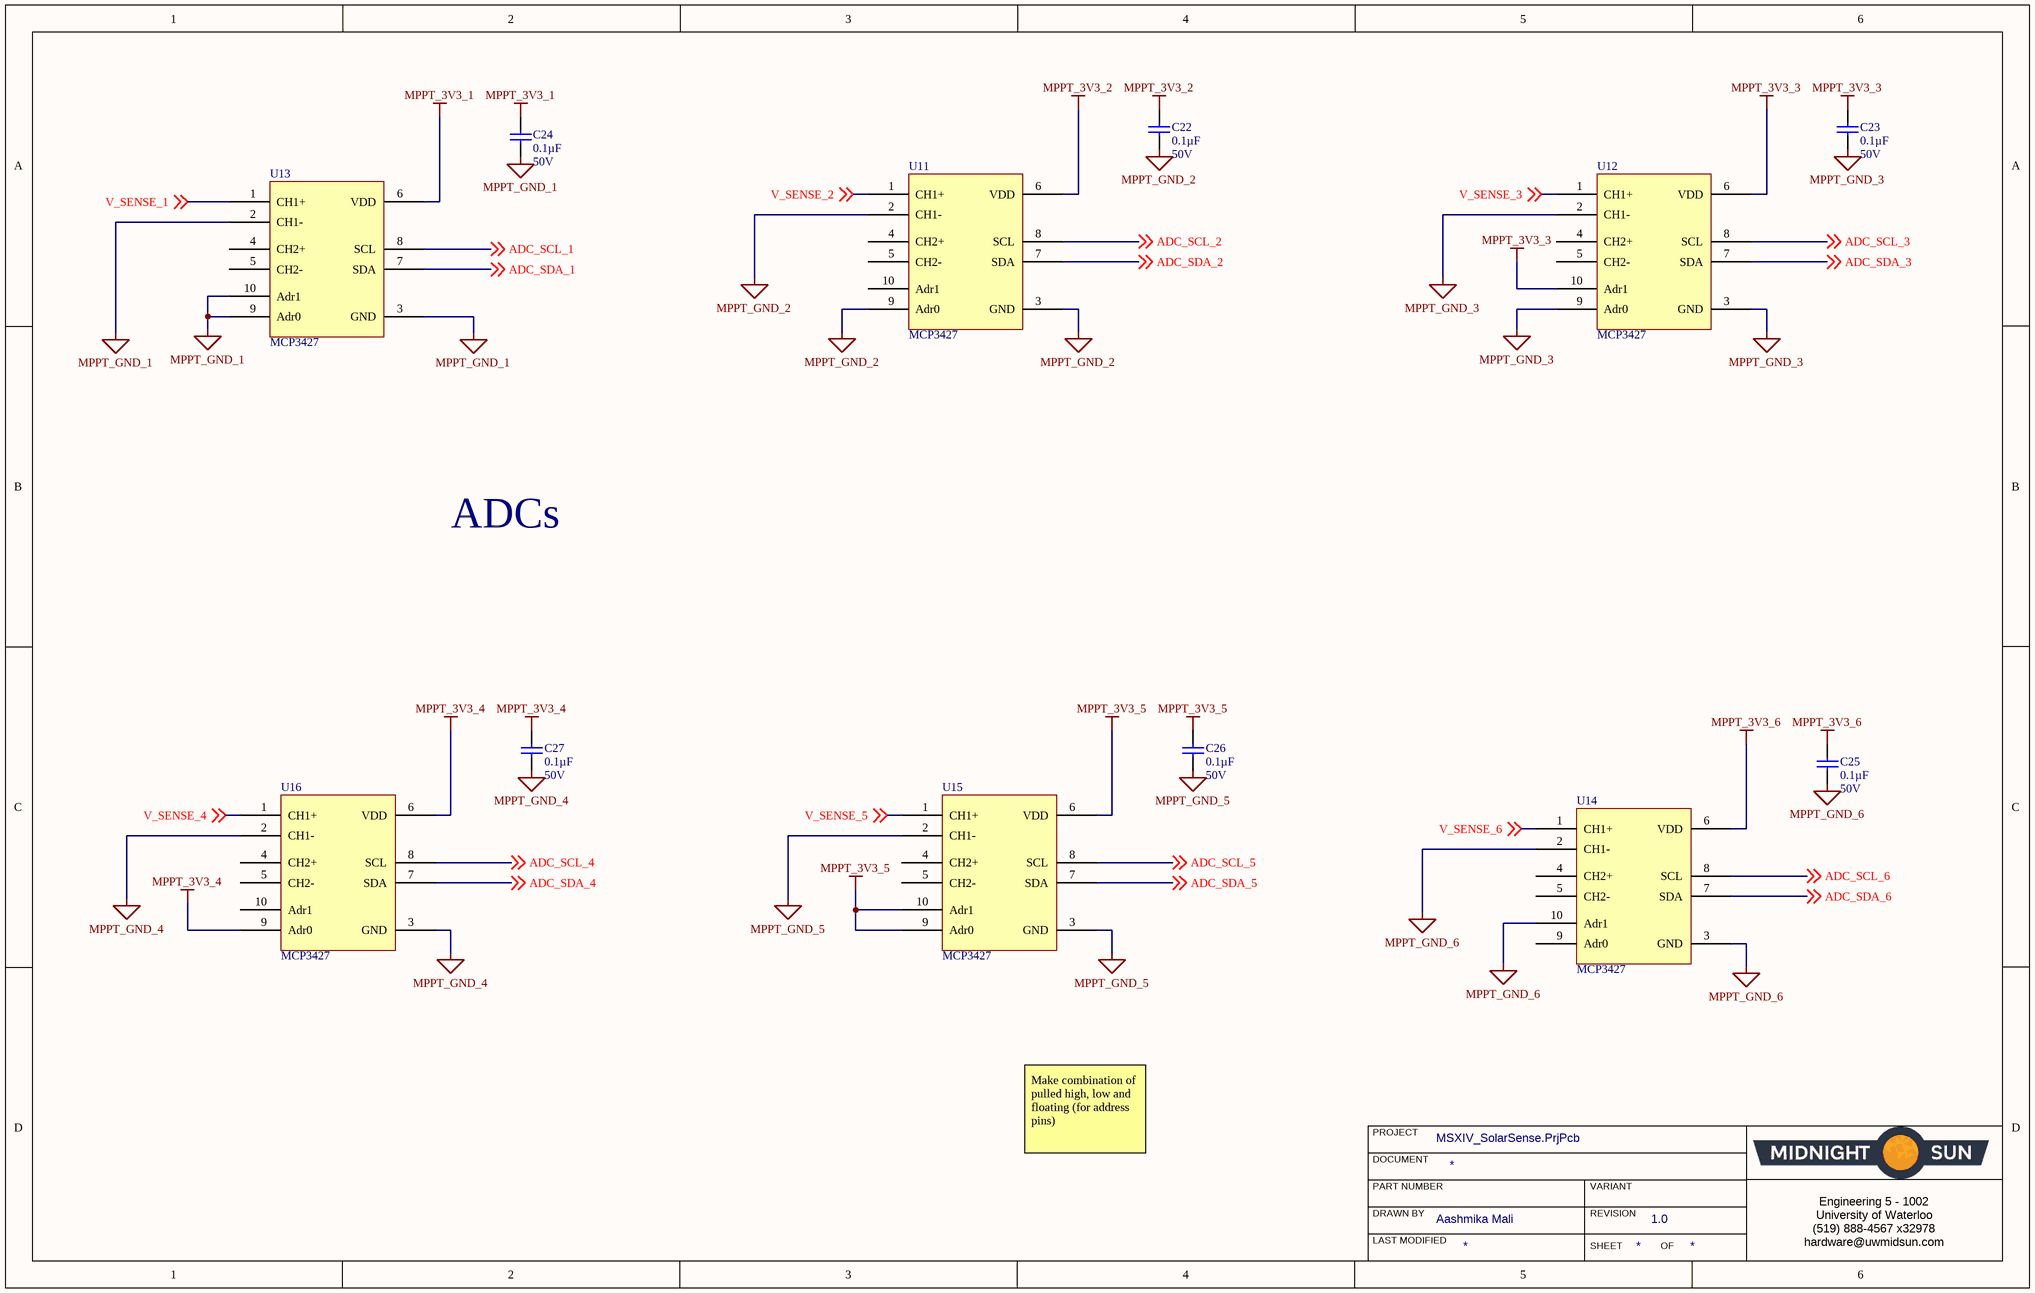
[diagram p2: ADCs.SchDoc]

### Parts
C22  Capacitance: 0.1µF  Voltage: 50V  [CAP, 0603]  (hidden comment: CAP CER 0.1UF 50V 10% X7R 0603)
C23  Capacitance: 0.1µF  Voltage: 50V  [CAP, 0603]  (hidden comment: CAP CER 0.1UF 50V 10% X7R 0603)
C24  Capacitance: 0.1µF  Voltage: 50V  [CAP, 0603]  (hidden comment: CAP CER 0.1UF 50V 10% X7R 0603)
C25  Capacitance: 0.1µF  Voltage: 50V  [CAP, 0603]  (hidden comment: CAP CER 0.1UF 50V 10% X7R 0603)
C26  Capacitance: 0.1µF  Voltage: 50V  [CAP, 0603]  (hidden comment: CAP CER 0.1UF 50V 10% X7R 0603)
C27  Capacitance: 0.1µF  Voltage: 50V  [CAP, 0603]  (hidden comment: CAP CER 0.1UF 50V 10% X7R 0603)
U11  Base Part Number: MCP3427  [IC ADC MCP3427]  (hidden comment: IC ADC MCP3427 10MSOP)
U12  Base Part Number: MCP3427  [IC ADC MCP3427]  (hidden comment: IC ADC MCP3427 10MSOP)
U13  Base Part Number: MCP3427  [IC ADC MCP3427]  (hidden comment: IC ADC MCP3427 10MSOP)
U14  Base Part Number: MCP3427  [IC ADC MCP3427]  (hidden comment: IC ADC MCP3427 10MSOP)
U15  Base Part Number: MCP3427  [IC ADC MCP3427]  (hidden comment: IC ADC MCP3427 10MSOP)
U16  Base Part Number: MCP3427  [IC ADC MCP3427]  (hidden comment: IC ADC MCP3427 10MSOP)

### Nets
MPPT_3V3_1: C24.1 U13.6(VDD)
MPPT_3V3_2: C22.1 U11.6(VDD)
MPPT_3V3_3: C23.1 U12.6(VDD) U12.10(Adr1)
MPPT_3V3_4: C27.1 U16.6(VDD) U16.9(Adr0)
MPPT_3V3_5: C26.1 U15.6(VDD) U15.9(Adr0) U15.10(Adr1)
MPPT_3V3_6: C25.1 U14.6(VDD)
MPPT_GND_1: C24.2 U13.2(CH1-) U13.3(GND) U13.9(Adr0) U13.10(Adr1)  [project net HV_HIGH_NEG_BAT_TERM]
MPPT_GND_2: C22.2 U11.2(CH1-) U11.3(GND) U11.9(Adr0)
MPPT_GND_3: C23.2 U12.2(CH1-) U12.3(GND) U12.9(Adr0)
MPPT_GND_4: C27.2 U16.2(CH1-) U16.3(GND)
MPPT_GND_5: C26.2 U15.2(CH1-) U15.3(GND)
MPPT_GND_6: C25.2 U14.2(CH1-) U14.3(GND) U14.10(Adr1)
ADC_SCL_1: U13.8(SCL) ; off-sheet ADC_SCL_1
ADC_SCL_2: U11.8(SCL) ; off-sheet ADC_SCL_2
ADC_SCL_3: U12.8(SCL) ; off-sheet ADC_SCL_3
ADC_SCL_4: U16.8(SCL) ; off-sheet ADC_SCL_4
ADC_SCL_5: U15.8(SCL) ; off-sheet ADC_SCL_5
ADC_SCL_6: U14.8(SCL) ; off-sheet ADC_SCL_6
ADC_SDA_1: U13.7(SDA) ; off-sheet ADC_SDA_1
ADC_SDA_2: U11.7(SDA) ; off-sheet ADC_SDA_2
ADC_SDA_3: U12.7(SDA) ; off-sheet ADC_SDA_3
ADC_SDA_4: U16.7(SDA) ; off-sheet ADC_SDA_4
ADC_SDA_5: U15.7(SDA) ; off-sheet ADC_SDA_5
ADC_SDA_6: U14.7(SDA) ; off-sheet ADC_SDA_6
V_SENSE_1: U13.1(CH1+) ; off-sheet V_SENSE_1
V_SENSE_2: U11.1(CH1+) ; off-sheet V_SENSE_2
V_SENSE_3: U12.1(CH1+) ; off-sheet V_SENSE_3
V_SENSE_4: U16.1(CH1+) ; off-sheet V_SENSE_4
V_SENSE_5: U15.1(CH1+) ; off-sheet V_SENSE_5
V_SENSE_6: U14.1(CH1+) ; off-sheet V_SENSE_6

Not connected (* = marked no-connect by the designer): U11 4(CH2+) 5(CH2-) 10(Adr1); U12 4(CH2+) 5(CH2-); U13 4(CH2+) 5(CH2-); U14 4(CH2+) 5(CH2-) 9(Adr0); U15 4(CH2+) 5(CH2-); U16 4(CH2+) 5(CH2-) 10(Adr1)

### Notes on the sheet
- ADCs
- Make combination of pulled high, low and floating (for address pins)
- PROJECT
- DOCUMENT
- DRAWN BY
- LAST MODIFIED
- PART NUMBER
- REVISION
- SHEET
- VARIANT
- OF
- Engineering 5 - 1002
  University of Waterloo
  (519) 888-4567 x32978
  hardware@uwmidsun.com

### Library data of the parts
C22-C27 = CAP CER 0.1UF 50V 10% X7R 0603: as C3 on sheet Controller_Board_Interface; Supplier 1: Digi-Key; Supplier Part Number 1: 478-5052-1-ND; Packaging: Cut Tape (CT); Part Status: Active; Operating Temperature: -55°C ~ 125°C; Ratings: -; Mounting Type: Surface Mount, MLCC; Package / Case: 0603 (1608 Metric); Size / Dimension: 0.063" L x 0.032" W (1.60mm x 0.81mm); Height - Seated (Max): -; Thickness (Max): 0.035" (0.90mm); Lead Spacing: -; Lead Style: -; ComponentLink1URL: http://datasheets.avx.com/X7RDielectric.pdf; ComponentLink1Description: http://datasheets.avx.com/X7RDielectric.pdf; Tolerance: ±10%; Temperature Coefficient: X7R
U11-U16 = IC ADC MCP3427 10MSOP: 16 Bit Analog to Digital Converter 2 Input 1 Sigma-Delta 10-MSOP; Manufacturer: Microchip Technology; Manufacturer Part Number: MCP3427-E/UN; Number of Bits: 16; Sampling Rate (Per Second): 15; Number of Inputs: 2; Input Type: Differential; Data Interface: I²C; Configuration: MUX-PGA-ADC; Reference Type: Internal; Voltage - Supply, Analog: 2.7 V ~ 5.5 V; Supplier 1: Digi-Key; RoHS: RoHS Compliant; Category: Integrated Circuits (ICs); Stock 1: 3001; Pricing 1: 1=4.32, 25=3.6064, 100=3.2704 (CAD); Packaging: Tube; Part Status: Active; Ratio - S/H:ADC: -; Architecture: Sigma-Delta; Voltage - Supply, Digital: 2.7 V ~ 5.5 V; Features: PGA, Selectable Address; Operating Temperature: -40°C ~ 125°C; Package / Case: 10-TFSOP, 10-MSOP (0.118", 3.00mm Width); Supplier Device Package: 10-MSOP; ComponentLink1URL: http://www.microchip.com/mymicrochip/filehandler.aspx?ddocname=en546216; ComponentLink1Description: http://www.microchip.com/mymicrochip/filehandler.aspx?ddocname=en546216; Supplier Part Number 1: MCP3427-E/UN-ND

## Sheet SPI_Interface.SchDoc
size B
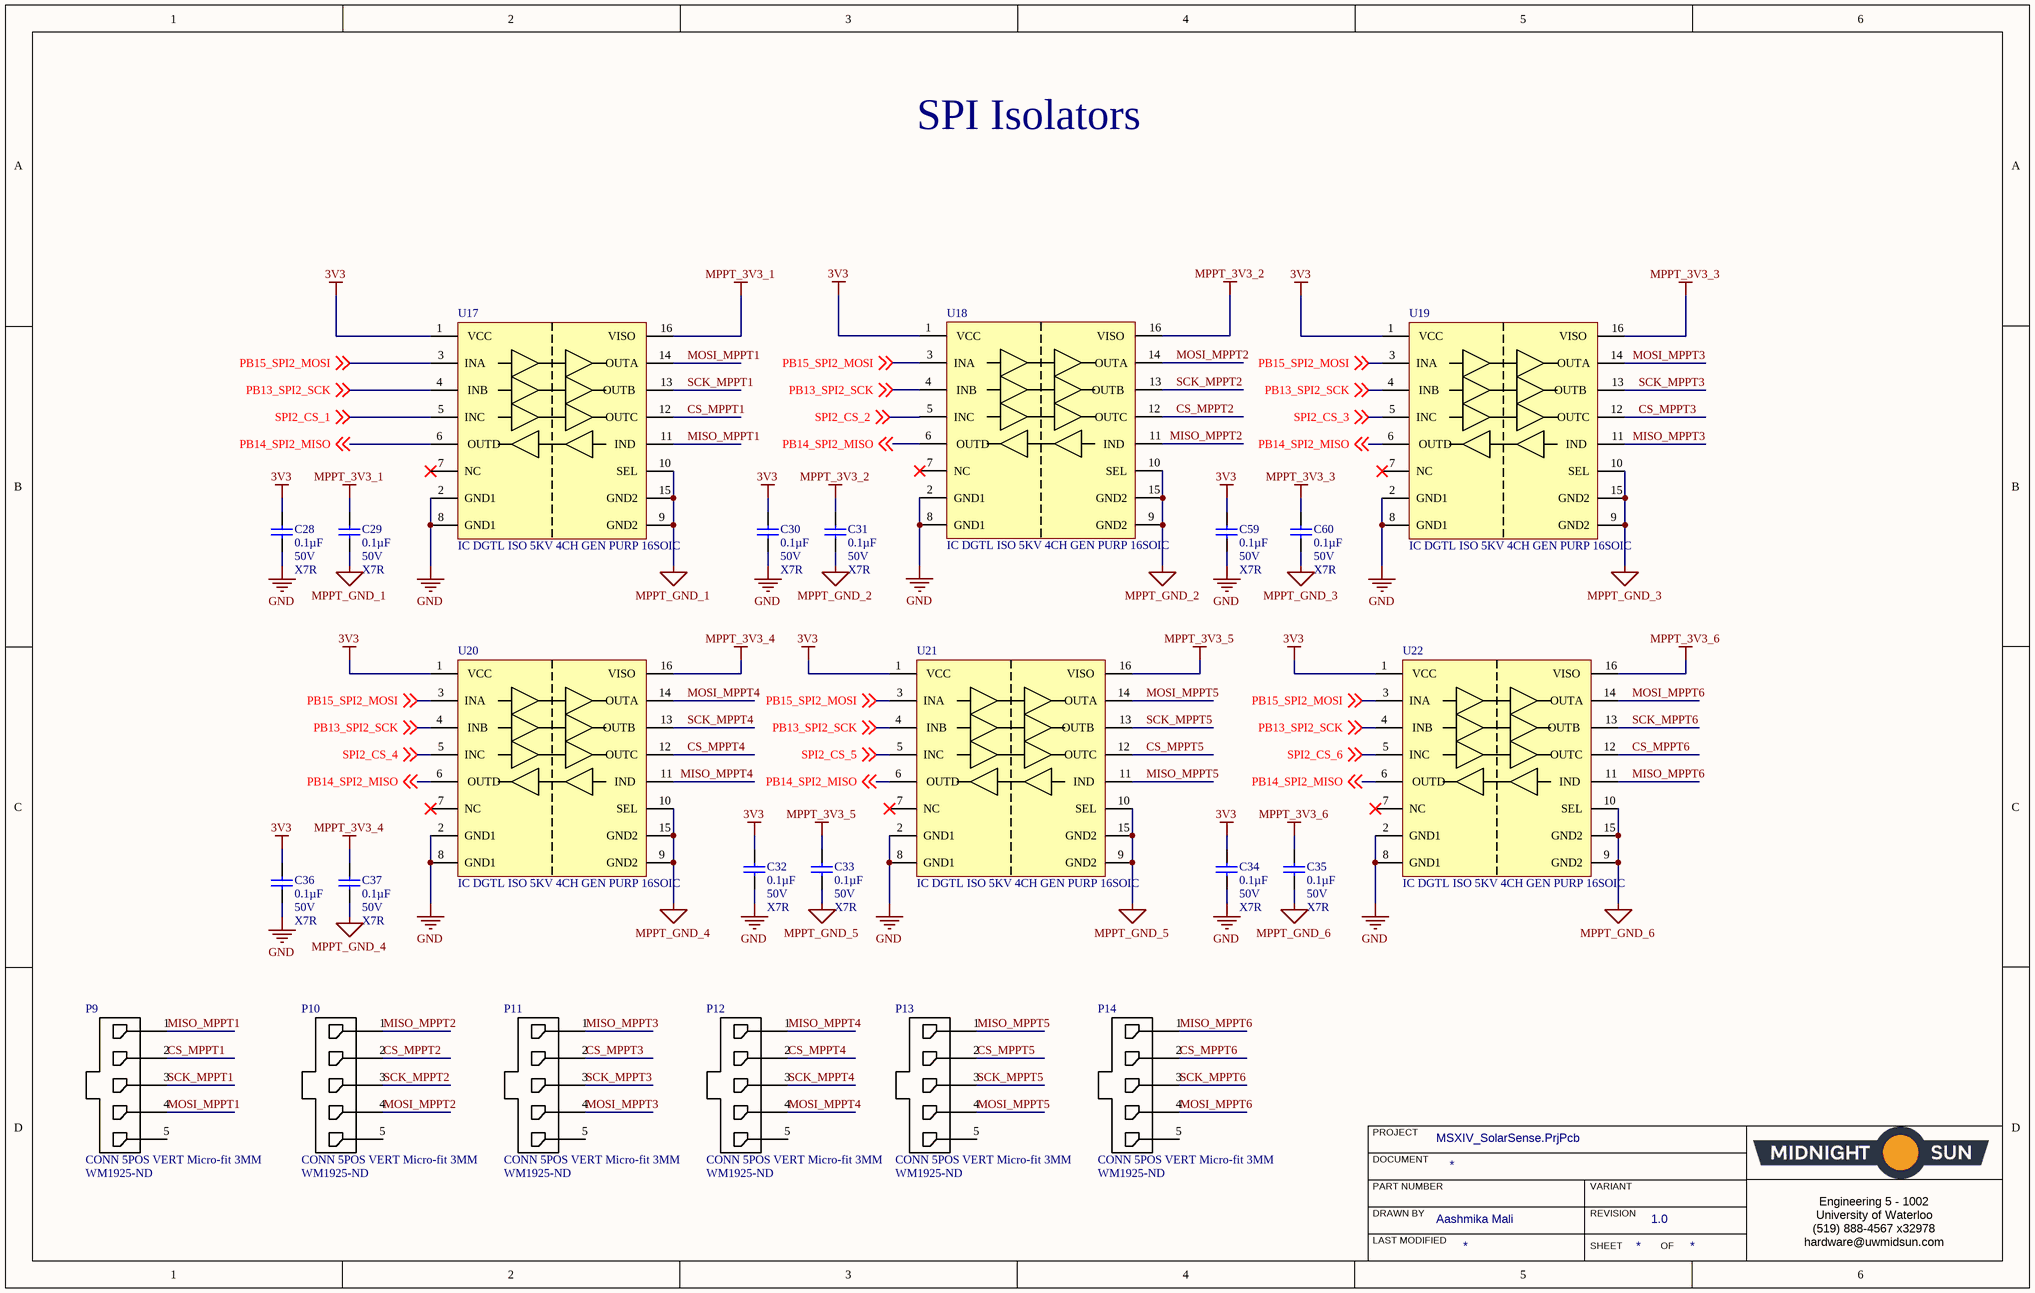
[diagram p3: SPI_Interface.SchDoc]

### Parts
C28  Capacitance: 0.1µF  Voltage: 50V  Temperature Coefficient: X7R  [CAP, 0603]  (hidden comment: CAP CER 0.1UF 50V 10% X7R 0603)
C29  Capacitance: 0.1µF  Voltage: 50V  Temperature Coefficient: X7R  [CAP, 0603]  (hidden comment: CAP CER 0.1UF 50V 10% X7R 0603)
C30  Capacitance: 0.1µF  Voltage: 50V  Temperature Coefficient: X7R  [CAP, 0603]  (hidden comment: CAP CER 0.1UF 50V 10% X7R 0603)
C31  Capacitance: 0.1µF  Voltage: 50V  Temperature Coefficient: X7R  [CAP, 0603]  (hidden comment: CAP CER 0.1UF 50V 10% X7R 0603)
C32  Capacitance: 0.1µF  Voltage: 50V  Temperature Coefficient: X7R  [CAP, 0603]  (hidden comment: CAP CER 0.1UF 50V 10% X7R 0603)
C33  Capacitance: 0.1µF  Voltage: 50V  Temperature Coefficient: X7R  [CAP, 0603]  (hidden comment: CAP CER 0.1UF 50V 10% X7R 0603)
C34  Capacitance: 0.1µF  Voltage: 50V  Temperature Coefficient: X7R  [CAP, 0603]  (hidden comment: CAP CER 0.1UF 50V 10% X7R 0603)
C35  Capacitance: 0.1µF  Voltage: 50V  Temperature Coefficient: X7R  [CAP, 0603]  (hidden comment: CAP CER 0.1UF 50V 10% X7R 0603)
C36  Capacitance: 0.1µF  Voltage: 50V  Temperature Coefficient: X7R  [CAP, 0603]  (hidden comment: CAP CER 0.1UF 50V 10% X7R 0603)
C37  Capacitance: 0.1µF  Voltage: 50V  Temperature Coefficient: X7R  [CAP, 0603]  (hidden comment: CAP CER 0.1UF 50V 10% X7R 0603)
C59  Capacitance: 0.1µF  Voltage: 50V  Temperature Coefficient: X7R  [CAP, 0603]  (hidden comment: CAP CER 0.1UF 50V 10% X7R 0603)
C60  Capacitance: 0.1µF  Voltage: 50V  Temperature Coefficient: X7R  [CAP, 0603]  (hidden comment: CAP CER 0.1UF 50V 10% X7R 0603)
P9  CONN 5POS VERT Micro-fit 3MM  Supplier Part Number 1: WM1925-ND  [CONN, 5POS MICRO-FIT 3mm]
P10  CONN 5POS VERT Micro-fit 3MM  Supplier Part Number 1: WM1925-ND  [CONN, 5POS MICRO-FIT 3mm]
P11  CONN 5POS VERT Micro-fit 3MM  Supplier Part Number 1: WM1925-ND  [CONN, 5POS MICRO-FIT 3mm]
P12  CONN 5POS VERT Micro-fit 3MM  Supplier Part Number 1: WM1925-ND  [CONN, 5POS MICRO-FIT 3mm]
P13  CONN 5POS VERT Micro-fit 3MM  Supplier Part Number 1: WM1925-ND  [CONN, 5POS MICRO-FIT 3mm]
P14  CONN 5POS VERT Micro-fit 3MM  Supplier Part Number 1: WM1925-ND  [CONN, 5POS MICRO-FIT 3mm]
U17  IC DGTL ISO 5KV 4CH GEN PURP 16SOIC  [ISOW7841FDWER SOIC-16]
U18  IC DGTL ISO 5KV 4CH GEN PURP 16SOIC  [ISOW7841FDWER SOIC-16]
U19  IC DGTL ISO 5KV 4CH GEN PURP 16SOIC  [ISOW7841FDWER SOIC-16]
U20  IC DGTL ISO 5KV 4CH GEN PURP 16SOIC  [ISOW7841FDWER SOIC-16]
U21  IC DGTL ISO 5KV 4CH GEN PURP 16SOIC  [ISOW7841FDWER SOIC-16]
U22  IC DGTL ISO 5KV 4CH GEN PURP 16SOIC  [ISOW7841FDWER SOIC-16]

### Nets
3V3: C28.1 C30.1 C32.1 C34.1 C36.1 C59.1 U17.1(VCC) U18.1(VCC) U19.1(VCC) U20.1(VCC) U21.1(VCC) U22.1(VCC)
GND: C28.2 C30.2 C32.2 C34.2 C36.2 C59.2 U17.2(GND1) U17.8(GND1) U18.2(GND1) U18.8(GND1) U19.2(GND1) U19.8(GND1) U20.2(GND1) U20.8(GND1) U21.2(GND1) U21.8(GND1) U22.2(GND1) U22.8(GND1)
MPPT_3V3_1: C29.1 U17.16(VISO)
MPPT_3V3_2: C31.1 U18.16(VISO)
MPPT_3V3_3: C60.1 U19.16(VISO)
MPPT_3V3_4: C37.1 U20.16(VISO)
MPPT_3V3_5: C33.1 U21.16(VISO)
MPPT_3V3_6: C35.1 U22.16(VISO)
MPPT_GND_1: C29.2 U17.9(GND2) U17.10(SEL) U17.15(GND2)  [project net HV_HIGH_NEG_BAT_TERM]
MPPT_GND_2: C31.2 U18.9(GND2) U18.10(SEL) U18.15(GND2)
MPPT_GND_3: C60.2 U19.9(GND2) U19.10(SEL) U19.15(GND2)
MPPT_GND_4: C37.2 U20.9(GND2) U20.10(SEL) U20.15(GND2)
MPPT_GND_5: C33.2 U21.9(GND2) U21.10(SEL) U21.15(GND2)
MPPT_GND_6: C35.2 U22.9(GND2) U22.10(SEL) U22.15(GND2)
CS_MPPT1: P9.2 U17.12(OUTC)
CS_MPPT2: P10.2 U18.12(OUTC)
CS_MPPT3: P11.2 U19.12(OUTC)
CS_MPPT4: P12.2 U20.12(OUTC)
CS_MPPT5: P13.2 U21.12(OUTC)
CS_MPPT6: P14.2 U22.12(OUTC)
MISO_MPPT1: P9.1 U17.11(IND)
MISO_MPPT2: P10.1 U18.11(IND)
MISO_MPPT3: P11.1 U19.11(IND)
MISO_MPPT4: P12.1 U20.11(IND)
MISO_MPPT5: P13.1 U21.11(IND)
MISO_MPPT6: P14.1 U22.11(IND)
MOSI_MPPT1: P9.4 U17.14(OUTA)
MOSI_MPPT2: P10.4 U18.14(OUTA)
MOSI_MPPT3: P11.4 U19.14(OUTA)
MOSI_MPPT4: P12.4 U20.14(OUTA)
MOSI_MPPT5: P13.4 U21.14(OUTA)
MOSI_MPPT6: P14.4 U22.14(OUTA)
PB13_SPI2_SCK: U17.4(INB) U18.4(INB) U19.4(INB) U20.4(INB) U21.4(INB) U22.4(INB) ; off-sheet PB13_SPI2_SCK
PB14_SPI2_MISO: U17.6(OUTD) U18.6(OUTD) U19.6(OUTD) U20.6(OUTD) U21.6(OUTD) U22.6(OUTD) ; off-sheet PB14_SPI2_MISO
PB15_SPI2_MOSI: U17.3(INA) U18.3(INA) U19.3(INA) U20.3(INA) U21.3(INA) U22.3(INA) ; off-sheet PB15_SPI2_MOSI
SCK_MPPT1: P9.3 U17.13(OUTB)
SCK_MPPT2: P10.3 U18.13(OUTB)
SCK_MPPT3: P11.3 U19.13(OUTB)
SCK_MPPT4: P12.3 U20.13(OUTB)
SCK_MPPT5: P13.3 U21.13(OUTB)
SCK_MPPT6: P14.3 U22.13(OUTB)
SPI2_CS_1: U17.5(INC) ; off-sheet SPI2_CS_1
SPI2_CS_2: U18.5(INC) ; off-sheet SPI2_CS_2
SPI2_CS_3: U19.5(INC) ; off-sheet SPI2_CS_3
SPI2_CS_4: U20.5(INC) ; off-sheet SPI2_CS_4
SPI2_CS_5: U21.5(INC) ; off-sheet SPI2_CS_5
SPI2_CS_6: U22.5(INC) ; off-sheet SPI2_CS_6

Not connected (* = marked no-connect by the designer): P9 5; P10 5; P11 5; P12 5; P13 5; P14 5; U17 7(NC)*; U18 7(NC)*; U19 7(NC)*; U20 7(NC)*; U21 7(NC)*; U22 7(NC)*

### Notes on the sheet
- SPI Isolators
- PROJECT
- DOCUMENT
- DRAWN BY
- LAST MODIFIED
- PART NUMBER
- REVISION
- SHEET
- VARIANT
- OF
- Engineering 5 - 1002
  University of Waterloo
  (519) 888-4567 x32978
  hardware@uwmidsun.com

### Library data of the parts
C28-C37 C59 C60 = CAP CER 0.1UF 50V 10% X7R 0603: as C3 on sheet Controller_Board_Interface; Supplier 1: Digi-Key; Supplier Part Number 1: 478-5052-1-ND; Packaging: Cut Tape (CT); Part Status: Active; Operating Temperature: -55°C ~ 125°C; Ratings: -; Mounting Type: Surface Mount, MLCC; Package / Case: 0603 (1608 Metric); Size / Dimension: 0.063" L x 0.032" W (1.60mm x 0.81mm); Height - Seated (Max): -; Thickness (Max): 0.035" (0.90mm); Lead Spacing: -; Lead Style: -; ComponentLink1URL: http://datasheets.avx.com/X7RDielectric.pdf; ComponentLink1Description: http://datasheets.avx.com/X7RDielectric.pdf; Tolerance: ±10%
P9-P14 = CONN 5POS VERT Micro-fit 3MM: Conn Power HDR 5 POS 3mm Solder ST Thru-Hole 5 Terminal 1 Port Micro-Fit 3.0™ Tray; Manufacturer: Molex; Manufacturer Part Number: 0436500516; Number of Positions: 5; Connector Type: Male Pin; Number of Ports: 1; Max Voltage Rating (AC): 250V; Supplier 1: Digi-Key; RoHS: Yes; Category: Headers and Wire Housings; Stock 1: 1615; Pricing 1: 1=1.52000, 10=1.38200, 100=1.18480, 500=0.98736, 1000=0.84630, 5000=0.75039, 10000=0.73346 (USD); Mount: Through Hole; Color: Black; Housing Material: Polymer; Contact Material: Brass; Contact Plating: Gold; Number of Terminals: 5; Min Operating Temperature: -40°C; Max Operating Temperature: 105°C; Packaging: Tray; Termination: Solder; Orientation: Straight; Number of Rows: 1; Number of Contacts: 5; Fastening Type: Ramp; Length: 18.65mm; Pitch: 3mm; Depth: 5.57mm; ComponentLink1URL: https://datasheet.ciiva.com/6813/436500516-sd-6813986.pdf?src-supplier=Digi-Key; ComponentLink1Description: https://datasheet.ciiva.com/6813/436500516-sd-6813986.pdf?src-supplier=Digi-Key; ComponentLink2URL: https://datasheet.ciiva.com/3943/304280436500516-pcb-headers-3943315.pdf?src-supplier=Arrow; ComponentLink2Description: https://datasheet.ciiva.com/3943/304280436500516-pcb-headers-3943315.pdf?src-supplier=Arrow
U17-U22 = IC DGTL ISO 5KV 4CH GEN PURP 16SOIC: General Purpose Digital Isolator 5000Vrms 4 Channel 100Mbps 100kV/µs CMTI 16-SOIC (0.295", 7.50mm Width); Manufacturer 1: Texas Instruments; Manufacturer Part Number 1: ISOW7841FDWER; Number of Channels: 4; RoHS: No; Min Operating Temperature: -40°C; Max Operating Temperature: 125°C; Supplier 1: TI store; Supplier Part Number 1: ISOW7841FDWER; Stock 1: 4512; Pricing 1: 1=9.44000, 10=8.50000, 25=7.93000, 100=7.12000, 250=6.64000, 500=5.78000, 750=5.00000, 1000=4.90000 (USD); ComponentLink3URL: http://www.ti.com/lit/ds/symlink/isow7841.pdf?src-supplier=Digi-Key; ComponentLink3Description: http://www.ti.com/lit/ds/symlink/isow7841.pdf?src-supplier=Digi-Key; ComponentLink4URL: http://www.ti.com/general/docs/lit/getliterature.tsp?genericPartNumber=ISOW7841&fileType=pdf&src-supplier=Farnell; ComponentLink4Description: http://www.ti.com/general/docs/lit/getliterature.tsp?genericPartNumber=ISOW7841&fileType=pdf&src-supplier=Farnell